# EAGLE design Controller (EAGLE 6.5.0)
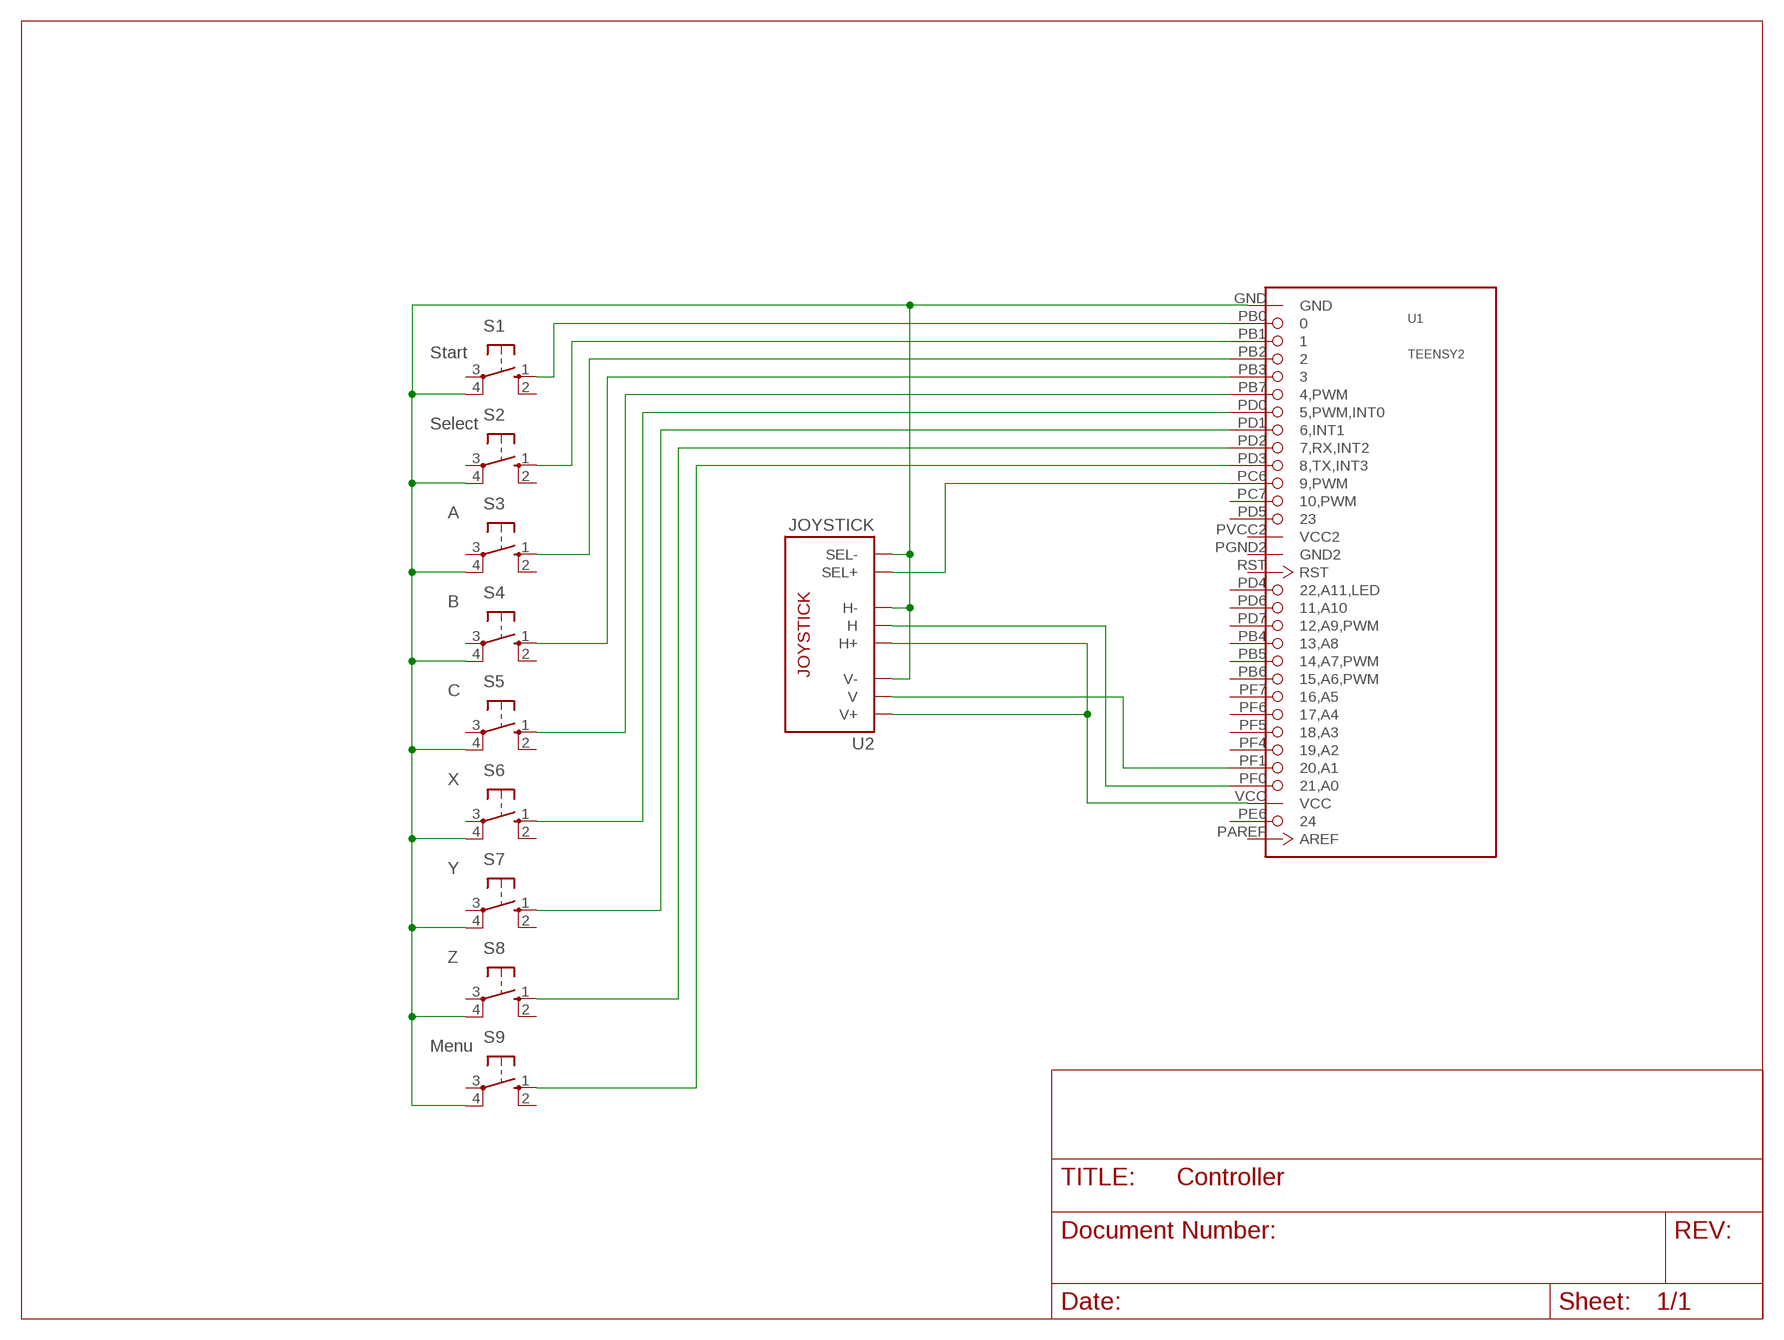
[diagram p0: schematic, sheet 1]

## Parts
S1  10-XX  [B3F-10XX]
S2  10-XX  [B3F-10XX]
S3  10-XX  [B3F-10XX]
S4  10-XX  [B3F-10XX]
S5  10-XX  [B3F-10XX]
S6  10-XX  [B3F-10XX]
S7  10-XX  [B3F-10XX]
S8  10-XX  [B3F-10XX]
S9  10-XX  [B3F-10XX]
U1  TEENSY2  TEENSY2-ARDUINO  [TEENSY2]
U2  JOYSTICK  JOYSTICKPTH  [JOYSTICK]

## Nets
N$1: S1.1(S) U1.PB0
N$2: S2.1(S) U1.PB1
N$3: S3.1(S) U1.PB2
N$4: S4.1(S) U1.PB3
N$5: S5.1(S) U1.PB7(4,PWM)
N$6: S6.1(S) U1.PD0(5,PWM,INT0)
N$7: S7.1(S) U1.PD1(6,INT1)
N$8: S8.1(S) U1.PD2(7,RX,INT2)
N$9: U1.PC6(9,PWM) U2.B1A(SEL+)
N$10: U1.VCC U2.H1(H+) U2.V1(V+)
N$11: U1.PF0(21,A0) U2.H2(H)
N$12: S9.1(S) U1.PD3(8,TX,INT3)
N$13: S1.4(P1) S2.4(P1) S3.4(P1) S4.4(P1) S5.4(P1) S6.4(P1) S7.4(P1) S8.4(P1) S9.4(P1) U1.GND U2.B2A(SEL-) U2.H3(H-) U2.V3(V-)
N$14: U1.PF1(20,A1) U2.V2(V)
Unconnected: S1.2(S1) S1.3(P) S2.2(S1) S2.3(P) S3.2(S1) S3.3(P) S4.2(S1) S4.3(P) S5.2(S1) S5.3(P) S6.2(S1) S6.3(P) S7.2(S1) S7.3(P) S8.2(S1) S8.3(P) S9.2(S1) S9.3(P) U1.PAREF(AREF) U1.PB4(13,A8) U1.PB5(14,A7,PWM) U1.PB6(15,A6,PWM) U1.PC7(10,PWM) U1.PD4(22,A11,LED) U1.PD5 U1.PD6(11,A10) U1.PD7(12,A9,PWM) U1.PE6 U1.PF4(19,A2) U1.PF5(18,A3) U1.PF6(17,A4) U1.PF7(16,A5) U1.RST

## Notes on the sheet
- Start
- Select
- A
- B
- C
- X
- Y
- Z
- Menu

## Power pins joined to a net without a drawn wire
GND2: U1.PGND2(GND2)
VCC2: U1.PVCC2(VCC2)

## Library data of the parts
S1-S9 = switch-omron:10-XX: OMRON SWITCH; MPN: B3F-1000; OC_FARNELL: 176432; OC_NEWARK: 36M3542
U1 = teensy2:TEENSY2-ARDUINO
U2 = SparkFun-Electromechanical:JOYSTICK: Thumb Joystick Joystick commonly found in PS2 controllers. Two pots and a select switch. Footprint proven. Spark Fun Electronics SKU : COM-09032

## Board
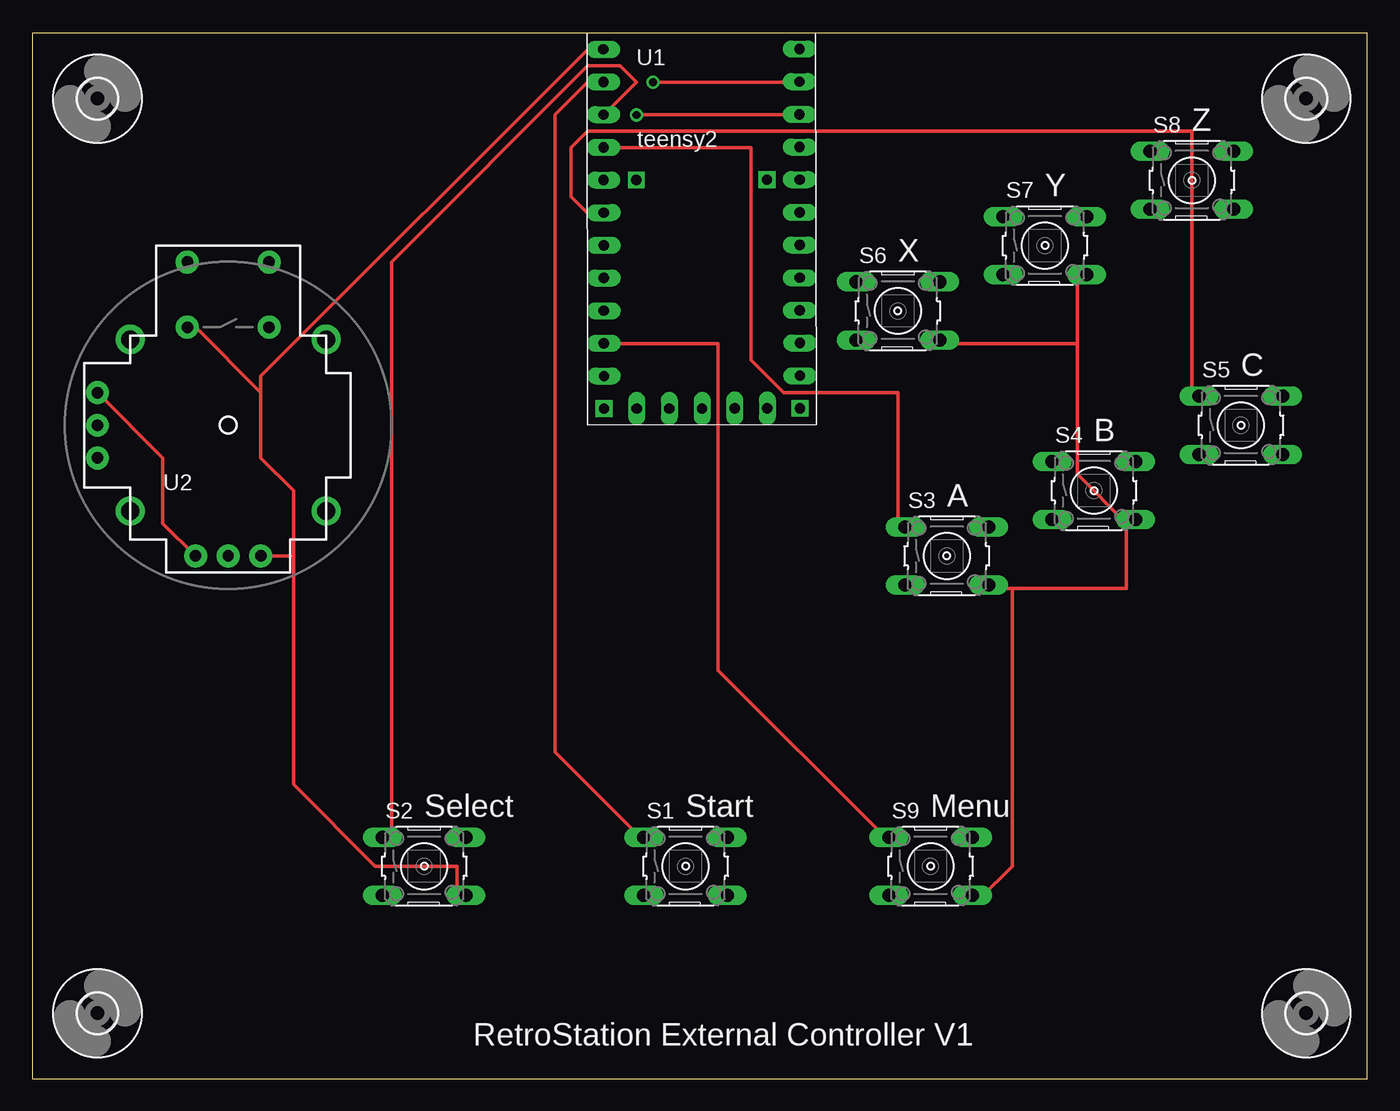
[diagram p1: board, top side]
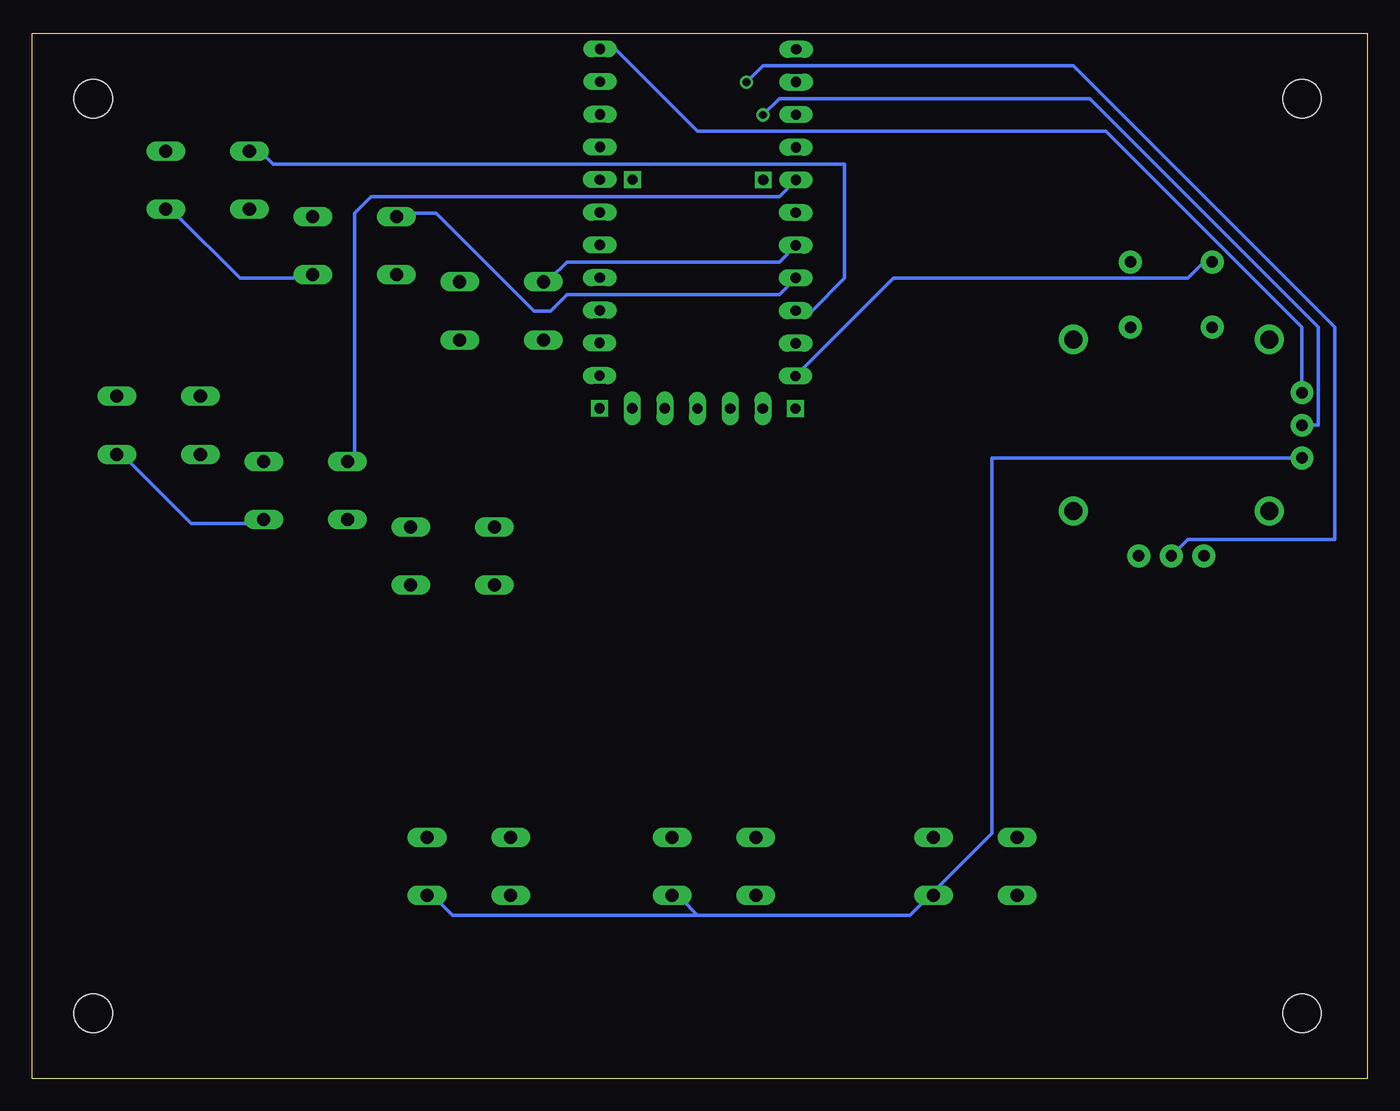
[diagram p2: board, bottom side, seen from below]

Size 103.81 x 81.27 mm. Coordinates in mm from the lower left corner, seen from the top.
Outline: 0,0 103.81,0 103.81,81.27 0,81.27 0,0
Copper layers (1*16): Top 0.035mm / dielectric 1.5mm / Bottom 0.035mm
Design rules "default": minimum track width 10mil, minimum drill 24mil, track to track 8mil, track to pad 8mil, pad to pad 8mil, via to via 8mil, smd to smd 8mil, copper to edge 40mil, drill to drill 8mil, minimum pad ring 10mil, minimum via ring 8mil, stop-mask expansion 4mil, vias tented up to drill 0mil, thermal gap 10mil

### Footprints (pad centres in the part's own frame; a part is rotated, then mirrored left to right if it is on the bottom)
B3F-10XX = drill 1.016 long: 1 -3.251,2.261; 2 3.251,2.261; 3 -3.251,-2.261; 4 3.251,-2.261
TEENSY2 = drill 0.8 long: GND 12.7,21.59; PB0 12.7,19.05; PB1 12.7,16.51; PB2 12.7,13.97; PB3 12.7,11.43; PB4 27.94,-1.27; PB5 27.94,1.27; PB6 27.94,3.81; PB7 12.7,8.89; PC6 12.7,-3.81; PD0 12.7,6.35; PD1 12.7,3.81; PD2 12.7,1.27; PD3 12.7,-1.27; PD4 25.4,-6.35; PD5 15.24,-6.35; PD7 27.94,-3.81; PF0 27.94,19.05; PF1 27.94,16.51; PF4 27.94,13.97; PF5 27.94,11.43; PF6 27.94,8.89; PF7 27.94,6.35; PGND2 20.32,-6.35; PVCC2 17.78,-6.35; RST 22.86,-6.35; VCC 27.94,21.59 | drill 0.8 square: PAREF 25.4,11.43; PC7 12.7,-6.35; PD6 27.94,-6.35; PE6 15.24,11.43
JOYSTICK = drill 0.9 pad 1.778: B1A -3.175,12.7; B1B 3.175,12.7; B2A -3.175,7.62; B2B 3.175,7.62 | drill 0.889 pad 1.778: H1 -2.54,-10.16; H2 0,-10.16; H3 2.54,-10.16; V1 -10.16,2.54; V2 -10.16,0; V3 -10.16,-2.54 | drill 1.397 pad 2.286: MOUNT1 -7.62,6.668; MOUNT2 -7.62,-6.668; MOUNT3 7.62,-6.668; MOUNT4 7.62,6.668
3,0 = hole 3: 0,0

### Placement (x,y rotation side)
S1  50.8,16.51 0 top
S2  30.48,16.51 0 top
S3  71.12,40.64 0 top
S4  82.55,45.72 0 top
S5  93.98,50.8 0 top
S6  67.31,59.69 0 top
S7  78.74,64.77 0 top
S8  90.17,69.85 0 top
S9  69.85,16.51 0 top
U1  31.75,58.42 0.1 top
U2  15.24,50.8 0 top
U$1  [3,0]  99.06,5.08 0 top
U$2  [3,0]  5.08,5.08 0 top
U$3  [3,0]  99.06,76.2 0 top
U$4  [3,0]  5.08,76.2 0 top

### Tracks (layer width: path | path; a pad name or v marks a point on that pad's centre or on a via)
N$1
  Top 0.254: U1.PB0 43.18,77.47 40.64,74.93 40.64,25.4 46.99,19.05 S1.1
N$2
  Top 0.254: U1.PB1 44.45,74.93 46.99,77.47 45.72,78.74 43.18,78.74 27.94,63.5 27.94,19.05 S2.1
N$3
  Top 0.254: U1.PB2 44.45,72.39 55.88,72.39 55.88,55.88 58.42,53.34 67.31,53.34 67.31,43.18 S3.1
N$4
  Bottom 0.254: U1.PB3 44.45,69.85 45.72,68.58 77.47,68.58 78.74,67.31 78.74,48.26 S4.1
N$5
  Top 0.254: U1.PB7 43.18,67.31 41.91,68.58 41.91,72.39 43.18,73.66 90.17,73.66 90.17,53.34 S5.1
N$6
  Bottom 0.254: U1.PD0 44.45,64.77 45.72,63.5 62.23,63.5 63.5,62.23 S6.1
N$7
  Bottom 0.254: U1.PD1 44.45,62.23 45.72,60.96 62.23,60.96 63.5,59.69 64.77,59.69 72.39,67.31 74.93,67.31 S7.1
N$8
  Bottom 0.254: U1.PD2 43.18,59.69 40.64,62.23 40.64,71.12 85.09,71.12 86.36,72.39 S8.1
N$9
  Bottom 0.254: U1.PC6 44.45,54.61 36.83,62.23 13.97,62.23 12.7,63.5 U2.B1A
N$10
  Top 0.254: U2.H1 10.16,43.18 10.16,48.26 U2.V1
  Bottom 0.254: U2.V1 5.08,58.42 20.32,73.66 52.07,73.66 58.42,80.01 U1.VCC
N$11  (via drill 0.61)
  Top 0.254: v48.26,77.47 58.42,77.47 U1.PF0
  Bottom 0.254: v48.26,77.47 46.99,78.74 22.86,78.74 2.54,58.42 2.54,41.91 13.97,41.91 U2.H2
N$12
  Top 0.254: U1.PD3 45.72,57.15 53.34,57.15 53.34,31.75 66.04,19.05 S9.1
N$13
  Top 0.254: 17.78,53.34 17.78,48.26 20.32,45.72 20.32,40.64 | 17.78,53.34 17.78,54.61 43.18,80.01 U1.GND | 17.78,53.34 12.7,58.42 U2.B2A | 76.2,38.1 85.09,38.1 85.09,43.18 | 76.2,38.1 74.93,38.1 S3.4 | 81.28,57.15 71.12,57.15 S6.4 | 81.28,57.15 81.28,62.23 S7.4 | 85.09,43.18 81.28,46.99 81.28,57.15 | 85.09,43.18 S4.4 | 76.2,38.1 76.2,16.51 73.66,13.97 S9.4 | 20.32,40.64 20.32,22.86 26.67,16.51 33.02,16.51 33.02,13.97 S2.4 | 20.32,40.64 U2.H3
  Bottom 0.254: 34.29,13.97 35.56,12.7 52.07,12.7 | 52.07,12.7 53.34,13.97 S1.4 | 52.07,12.7 71.12,12.7 72.39,13.97 S9.4 | S5.4 96.52,48.26 91.44,43.18 86.36,43.18 S4.4 | S8.4 92.71,67.31 87.63,62.23 82.55,62.23 S7.4 | 34.29,13.97 29.21,19.05 29.21,48.26 U2.V3 | 34.29,13.97 S2.4
N$14  (via drill 0.61)
  Top 0.254: v46.99,74.93 58.42,74.93 U1.PF1
  Bottom 0.254: v46.99,74.93 45.72,76.2 21.59,76.2 3.81,58.42 3.81,50.8 U2.V2

### Text on the board
tNames: Z | Y | X | C | B | A | Select | Start | Menu | RetroStation External Controller V1